# Altium schematic sheet Driver.SchDoc
size A4; SheetNumber: 2; SheetTotal: 3; SPICEModelCacheOKJMLVYT: <root> / <DocumentId>OKJMLVYT</DocumentId> / <CacheFrame Number="0"> / <Model Name="umk316abj475_d-t" Kind="CKT"> / <Text>* UMK316ABJ475_D-T     SPICE MODEL  ( General Type ) / *-------------------------------------------------------------------------------------------------------- / * Model Generated by TAIYO YUDEN Corporation (http://www.ty-top.com) / * Version 1.0 / * TAIYO YUDEN Control No. 170508_100817 / * Copyright(c) 2012 TAIYO YUDEN CO.,LTD. All Rights Reserved. / *-------------------------------------------------------------------------------------------------------- / * / * Products Name : Multilayer Ceramic Capacitors / * / * Characteristics : / *     Capacitance : 4.7 uF , Rated Voltage : 50V , TCC : X5R / *     Case Size : 3.2 x 1.6 / 0.126 x 0.063 [mm/inch] , Thickness : 0.85 / 0.033 [mm/inch] / *     (Conditions: Temperature = 25 degC , DC Bias Current/Voltage = 0A / 0V) / * / * Frequency Range : 40Hz - 3GHz / * / * External Node Assignments : / * / *  1  o---| |---o  2 / * / *-------------------------------------------------------------------------------------------------------- / .SubCkt UMK316ABJ475_D-T 1 2 / **************************** / C0 1 110 4.046u / Cm 1 101 0.35498u / C1 101 102 0.72942u / Rc1 101 102 1.4231k / C2 102 103 0.27925u / Rc2 102 103 264.97 / C3 103 110 8383.9p / Rc3 103 110 5.6062 / C2m 1 301 0.48206u / C21 301 302 2.0783u / Rc21 301 302 4.5272k / C22 302 303 1.8889u / Rc22 302 303 3.5092k / C23 303 304 0.95238u / Rc23 303 304 5.7814k / C24 304 305 1.2242u / Rc24 304 305 227.36 / C25 305 306 0.82814u / Rc25 305 306 293.28 / C26 306 307 0.36607u / Rc26 306 307 80.665 / C27 307 308 0.030054u / Rc27 307 308 60.542 / C28 308 309 0.071245u / Rc28 308 309 14.818 / C29 309 110 1452.9p / Rc29 309 110 9.6886 / Rp0 1 110 21.2765957446809Meg / L0 110 120 0.27785n / Lm 120 130 0.31876n / L1 120 121 0.29686n / RL1 121 130 0.31082 / L2 120 122 0.41816n / RL2 122 130 0.37915 / L3 120 123 0.94452n / RL3 123 130 0.84341 / CR 120 124 0.42709u / LR 124 125 0.73026n / RR 125 130 79.488m / CL 130 140 0.50681p / LL 130 140 0.22381n / RL 130 140 31.219 / Rs 140 2 7.1209m / **************************** / .ends UMK316ABJ475_D-T</Text> / </Model> / </CacheFrame> / </root>
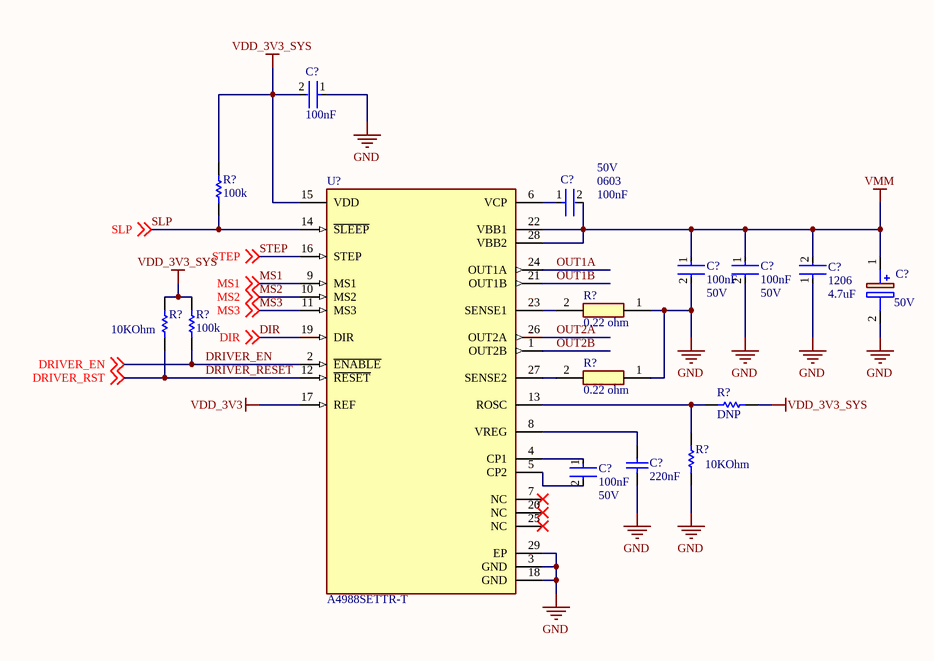
[diagram p0: Driver.SchDoc]

## Parts
(Parts that share a designator on the sheet are numbered #1, #2 ... from top to bottom, then left to right.)
C?#1  Capacitance: 100nF  [FP-CGA3E-0_3-0_1-IPC_A]  (hidden comment: CGA3E2X7R1H104K080AA)
C?#2  Voltage Rating: 50V  Case Code (Imperial): 0603  Capacitance: 100nF  [FP-CGA3E-0_3-0_1-IPC_A]  (hidden comment: CGA3E2X7R1H104K080AA)
C?#3  Capacitance: 100nF  Voltage Rating (DC): 50V  [FP-CGA3E-0_3-0_1-IPC_A]  (hidden comment: CGA3E2X7R1H104K080AA)
C?#4  Capacitance: 100nF  Voltage Rating (DC): 50V  [FP-CGA3E-0_3-0_1-IPC_A]  (hidden comment: CGA3E2X7R1H104K080AA)
C?#5  voltage rating: 50V  [EEE0JA331XP]  (hidden comment: EEE-FK1H470XP)
C?#6  Case/Package: 1206  Capacitance: 4.7uF  [FP-1206-L_3_2_0_2-W_1_6_0-IPC_B]  (hidden comment: UMK316ABJ475KD-T)
C?#7  Capacitance: 100nF  Voltage Rating (DC): 50V  [FP-CGA3E-0_3-0_1-IPC_A]  (hidden comment: CGA3E2X7R1H104K080AA)
C?#8  Parameter 1: 220nF  [CAPC1608X87X35NL15T15]  (hidden comment: C0603C224K8NACTU)
R?#1  value 100k  [RESC1609X55X30ML10T20]  (hidden comment: TNPW0603100KBEEN)
R?#2  value 100k  [RESC1609X55X30ML10T20]  (hidden comment: TNPW0603100KBEEN)
R?#3  value 0.22 ohm  [RESC6432X84N]  (hidden comment: RLP73K3AR22JTE)
R?#4  Resistance: 10KOhm  [RESC1609X55X30LL15T15]  (hidden comment: ERJ3EKF1002V)
R?#5  value 0.22 ohm  [RESC6432X84N]  (hidden comment: RLP73K3AR22JTE)
R?#6  Resistance: DNP  [RESC1608X55X25ML10T15]  (hidden comment: RC0603JR-070RL)  (net tie, no BOM)
R?#7  Resistance: 10KOhm  [RESC1609X55X30LL15T15]  (hidden comment: ERJ3EKF1002V)
U?  A4988SETTR-T  [FP-ET-28-MFG]

## Nets
GND: C?#1.1 C?#3.2 C?#4.2 C?#5.2(-) C?#6.1 C?#8.2 R?#3.1 R?#5.1 R?#7.1 U?.3(GND) U?.18(GND) U?.29(EP)
VDD_3V3: U?.17(REF)
VDD_3V3_SYS: C?#1.2 R?#1.1 R?#2.1 R?#4.2 R?#6.2 U?.15(VDD)
VMM: C?#2.2 C?#3.1 C?#4.1 C?#5.1(+) C?#6.2 U?.22(VBB1) U?.28(VBB2)
DIR: U?.19(DIR) ; off-sheet DIR
DRIVER_EN: R?#2.2 U?.2(~{ENABLE}) ; off-sheet DRIVER_EN
DRIVER_RESET: R?#4.1 U?.12(~{RESET}) ; off-sheet DRIVER_RST  [also labelled DRIVER_RST]
MS1: U?.9(MS1) ; off-sheet MS1
MS2: U?.10(MS2) ; off-sheet MS2
MS3: U?.11(MS3) ; off-sheet MS3
OUT1A: U?.24(OUT1A)
OUT1B: U?.21(OUT1B)
OUT2A: U?.26(OUT2A)
OUT2B: U?.1(OUT2B)
SLP: R?#1.2 U?.14(~{SLEEP}) ; off-sheet SLP
STEP: U?.16(STEP) ; off-sheet STEP
NetC?#2_1: C?#2.1 U?.6(VCP)
NetC?#7_1: C?#7.1 U?.4(CP1)
NetC?#7_2: C?#7.2 U?.5(CP2)
NetC?#8_1: C?#8.1 U?.8(VREG)
NetR?#3_2: R?#3.2 U?.23(SENSE1)
NetR?#5_2: R?#5.2 U?.27(SENSE2)
NetR?#6_1: R?#6.1 R?#7.2 U?.13(ROSC)

Not connected (* = marked no-connect by the designer): U? 7(NC)* 20(NC)* 25(NC)*

## Library data of the parts
C?#1-C?#4 C?#7 = CMP-2000-07546-2: Cap Ceramic 100nF 50V X7R 10% Pad SMD 0603 +125°C Automotive T/R; Weight: 7.1E-05oz; Composition: Ceramic; Max Operating Temperature: 125°C; Termination: SMD/SMT; Dielectric: X7R; Length: 1.6mm; Package Quantity: 1; REACH SVHC: No SVHC; Lead Free: Lead Free; Case Code (Metric): 1608; Min Operating Temperature: -55°C; Packaging: Tape and Reel; Tolerance: 10%; Case/Package: 0603; Depth: 0.8mm; Radiation Hardening: No; Ratings: AEC-Q200; Mount: Surface Mount; Voltage: 50V; Thickness: 0.035inch; Width: 0.8mm; Height: 0.8mm
  C?#1: Voltage Rating: 50V; Case Code (Imperial): 0603; Voltage Rating (DC): 50V
  C?#2: Voltage Rating (DC): 50V; Parameter 1: *
  C?#3 C?#4 C?#7: Voltage Rating: 50V; Case Code (Imperial): 0603
C?#5 = EEE-FK1H470XP: Capacitor Polarised; Manufacturer_Name: Panasonic; Datasheet Link: http://industrial.panasonic.com/cdbs/www-data/pdf/RDE0000/ABA0000C1181.pdf; Height: 7.8mm; Manufacturer_Part_Number: EEE-FK1H470XP; Mouser Part Number: 667-EEE-FK1H470XP; Mouser Price/Stock: https://www.mouser.co.uk/ProductDetail/Panasonic/EEE-FK1H470XP?qs=qE6bgDGEOCtuVppQsylaxg%3D%3D; Arrow Part Number: EEE-FK1H470XP; Arrow Price/Stock: https://www.arrow.com/en/products/eee-fk1h470xp/panasonic?region=europe; Parameter 2: *
C?#6 = CMP-14477-000107-2: None; Voltage Rating (DC): 50V; Tolerance: 10%; Dielectric: X5R; Mount: Surface Mount; RoHS Compliant: Yes; Height: 0.85mm; Case Code (Metric): 3216; Construction: Flat; Resistor Type: Ceramic; Number of Pins: 2; Depth: 1.6mm; Packaging: Tape and Reel; Max Operating Temperature: 85°C; Length: 3.2mm; Thickness: 0.037inch; Voltage Rating: 50V; Weight: 0.000571oz; Width: 0.063inch; Case Code (Imperial): 1206; Package Quantity: 1; Termination: SMD/SMT; Series: M; Radiation Hardening: No; Min Operating Temperature: -55°C
C?#8 = CMP-2006-03148-1: Manufacturer: Kemet; Part Number: C0603C224K8NACTU
R?#1 R?#2 = CMP-2000-03686-1: Manufacturer: Vishay Dale; Part Number: TNPW0603100KBEEN
R?#3 R?#5 = RLP73K3AR22JTE: Resistor; Manufacturer_Name: TE Connectivity; Datasheet Link: https://www.te.com/commerce/DocumentDelivery/DDEController?Action=showdoc&DocId=Customer+Drawing%7F2176058%7FBA%7Fpdf%7FEnglish%7FENG_CD_2176058_BA.pdf%7F3-2176058-3; Height: 0.84mm; Manufacturer_Part_Number: RLP73K3AR22JTE; Arrow Part Number: RLP73K3AR22JTE; Arrow Price/Stock: https://www.arrow.com/en/products/rlp73k3ar22jte/te-connectivity
R?#4 R?#7 = CMP-1012-00623-3: Chip Resistor, 10 KOhm, +/- 1%, 0.1 W, -55 to 155 degC, 0603 (1608 Metric), RoHS, Tape and Reel; Manufacturer: Panasonic; Voltage Rating: 75V; Case\/Package: 0603; Power Rating: 100mW; Temperature Coefficient: 100ppm\/degreesC; Number of Pins: 2; Package Reference: 603; Depth: 0.8mm; Mount: SurfaceMount; Package Description: 2-Pin Surface Mount Device, Body 1.6 x 0.85 mm; Datasheet Version: 02/2017; Length: 1.6mm; Lead Free: LeadFree; Height: 0.45mm; Number of Terminations: 2; Max Power Dissipation: 100mW; Min Operating Temperature: -55degC; Datasheet URL: https://industrial.panasonic.com/cdbs/www-data/pdf/RDA0000/AOA0000C304.pdf; Termination: SMD/SMT; Case Code (Metric): 1608; Case Code (Imperial): 0603; Tolerance: 1%; Max Operating Temperature: 155degC; RoHSCompliant: true; Voltage Rating (DC): 75V; Radiation Hardening: No; Packaging: TapeandReel; Composition: ThickFilm; Mounting Technology: SurfaceMount; Manufacturer URL: http://www.panasonic.com/; Width: 0.031inch; REACH SVHC: NoSVHC; Contact Plating: Tin; Military Standard: Not; Package Quantity: 1
R?#6 = CMP-2100-03667-1: Chip Resistor, 0 Ohm, +/- 5%, 0.1 W, -55 to 155 degC, 0603 (1608 Metric), RoHS, Tape and Reel; Manufacturer: Yageo; Temperature Coefficient: 200ppm/degreesC; Voltage Rating: 50V; Power Rating: 100mW; Width: 0.8mm; Max Operating Temperature: 155degC; Tolerance: 5%; Package Reference: 0603; Height: 0.45mm; Depth: 0.8mm; Package Description: 2-Pin Surface Mount Device, Body 1.6 x 0.8 mm; Termination: SMD/SMT; Package Quantity: 5000; Case/Package: 0603; Case Code (Imperial): 0603; Radiation Hardening: No; Number of Pins: 2; Length: 1.6mm; Lead Free: LeadFree; Voltage Rating (DC): 50V; Military Standard: Not; Datasheet URL: http://www.yageo.com/NewPortal/yageodocoutput?fileName=/pdf/R-Chip/PYu-RC_Group_51_RoHS_L_5.pdf; Manufacturer URL: http://www.yageo.com/; Packaging: TapeandReel; Case Code (Metric): 1608; Min Operating Temperature: -55degC; Composition: ThickFilm; RoHSCompliant: true; Contact Plating: Tin; Datasheet Version: Rev. 5, 10/2016; REACH SVHC: NoSVHC
U? = CMP-1742-00003-2: IC MTR DRVR BIPOLAR 3-5.5V 28QFN; Number of Outputs: 1; Motor Type: Stepper; Output Current: 2A; Min Supply Voltage: 8V; Output Voltage: 35V; Package Quantity: 1; Max Operating Temperature: 85°C; Case/Package: QFN EP; Mount: Surface Mount; Packaging: Tape and Reel; Radiation Hardening: No; REACH SVHC: No SVHC; Min Operating Temperature: -20°C; Max Supply Voltage: 35V; Number of Pins: 28